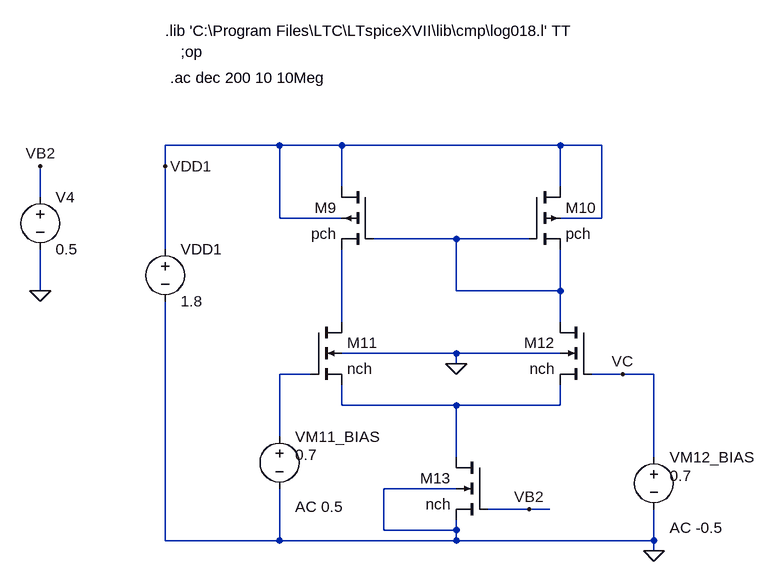
[diagram p0: schematic current_conveyor_tia_booster.asc]
current_conveyor_tia_booster.asc, the LTspice schematic file:
Version 4
SHEET 1 1192 1412
WIRE -160 -64 -336 -64
WIRE -64 -64 -160 -64
WIRE 272 -64 -64 -64
WIRE 336 -64 272 -64
WIRE -336 -32 -336 -64
WIRE -64 0 -64 -64
WIRE 272 0 272 -64
WIRE -528 16 -528 -32
WIRE -160 48 -160 -64
WIRE -64 48 -160 48
WIRE 336 48 336 -64
WIRE 336 48 272 48
WIRE 112 80 -16 80
WIRE 224 80 112 80
WIRE -336 96 -336 -32
WIRE -528 160 -528 96
WIRE 112 160 112 80
WIRE 272 160 272 96
WIRE 272 160 112 160
WIRE -64 208 -64 96
WIRE 272 208 272 160
WIRE 112 256 -64 256
WIRE 272 256 112 256
WIRE 112 272 112 256
WIRE -112 288 -160 288
WIRE 368 288 320 288
WIRE 416 288 368 288
WIRE -64 336 -64 304
WIRE 112 336 -64 336
WIRE 272 336 272 304
WIRE 272 336 112 336
WIRE -160 384 -160 288
WIRE 112 416 112 336
WIRE 416 416 416 288
WIRE 112 464 0 464
WIRE 224 496 160 496
WIRE 256 496 224 496
WIRE 0 528 0 464
WIRE 112 528 112 512
WIRE 112 528 0 528
WIRE -336 544 -336 176
WIRE -160 544 -160 464
WIRE -160 544 -336 544
WIRE 112 544 112 528
WIRE 112 544 -160 544
WIRE 416 544 416 496
WIRE 416 544 112 544
WIRE 416 560 416 544
FLAG -528 160 0
FLAG -528 -32 VB2
FLAG 112 272 0
FLAG 368 288 VC
FLAG 224 496 VB2
FLAG 416 560 0
FLAG -336 -32 VDD1
SYMBOL voltage -528 0 R0
WINDOW 123 0 0 Left 0
WINDOW 39 0 0 Left 0
SYMATTR InstName V4
SYMATTR Value 0.5
SYMBOL pmos4 -16 0 M0
SYMATTR InstName M9
SYMATTR Value pch
SYMATTR Value2 l=0.5u w=2u
SYMBOL pmos4 224 0 R0
SYMATTR InstName M10
SYMATTR Value pch
SYMATTR Value2 l=0.5u w=2u
SYMBOL nmos4 -112 208 R0
SYMATTR InstName M11
SYMATTR Value nch
SYMATTR Value2 l=0.5u w=2u
SYMBOL nmos4 320 208 M0
SYMATTR InstName M12
SYMATTR Value nch
SYMATTR Value2 l=0.5u w=2u
SYMBOL nmos4 160 416 M0
SYMATTR InstName M13
SYMATTR Value nch
SYMATTR Value2 l=0.5u w=1u
SYMBOL voltage 416 400 R0
WINDOW 123 24 124 Left 2
WINDOW 39 0 0 Left 0
WINDOW 3 24 44 Left 2
SYMATTR Value2 AC -0.5
SYMATTR InstName VM12_BIAS
SYMATTR Value 0.7
SYMBOL voltage -336 80 R0
WINDOW 123 0 0 Left 0
WINDOW 39 0 0 Left 0
SYMATTR InstName VDD1
SYMATTR Value 1.8
SYMBOL voltage -160 368 R0
WINDOW 123 24 124 Left 2
WINDOW 39 0 0 Left 0
WINDOW 3 24 44 Left 2
SYMATTR Value2 AC 0.5
SYMATTR InstName VM11_BIAS
SYMATTR Value 0.7
TEXT -336 -240 Left 2 !.lib 'C:\\Program Files\\LTC\\LTspiceXVII\\lib\\cmp\\log018.l' TT
TEXT -312 -208 Left 2 !;op
TEXT -328 -168 Left 2 !.ac dec 200 10 10Meg

The netlist it stands for:
* current_conveyor_tia_booster.asc
V4 VB2 0 0.5
M9 VDD1 N001 N002 VDD1 pch l=0.5u w=2u
M10 VDD1 N001 N001 VDD1 pch l=0.5u w=2u
M11 N002 N003 N004 0 nch l=0.5u w=2u
M12 N001 VC N004 0 nch l=0.5u w=2u
M13 N004 VB2 0 0 nch l=0.5u w=1u
VM12_BIAS VC 0 0.7 AC -0.5
VDD1 VDD1 0 1.8
VM11_BIAS N003 0 0.7 AC 0.5
.model NMOS NMOS
.model PMOS PMOS
.lib standard.mos
.lib 'C:\Program Files\LTC\LTspiceXVII\lib\cmp\log018.l' TT
;op
.ac dec 200 10 10Meg
.backanno
.end